# Altium schematic sheet RF_IN.SchDoc
size A3; SheetNumber: 2; SheetTotal: 12
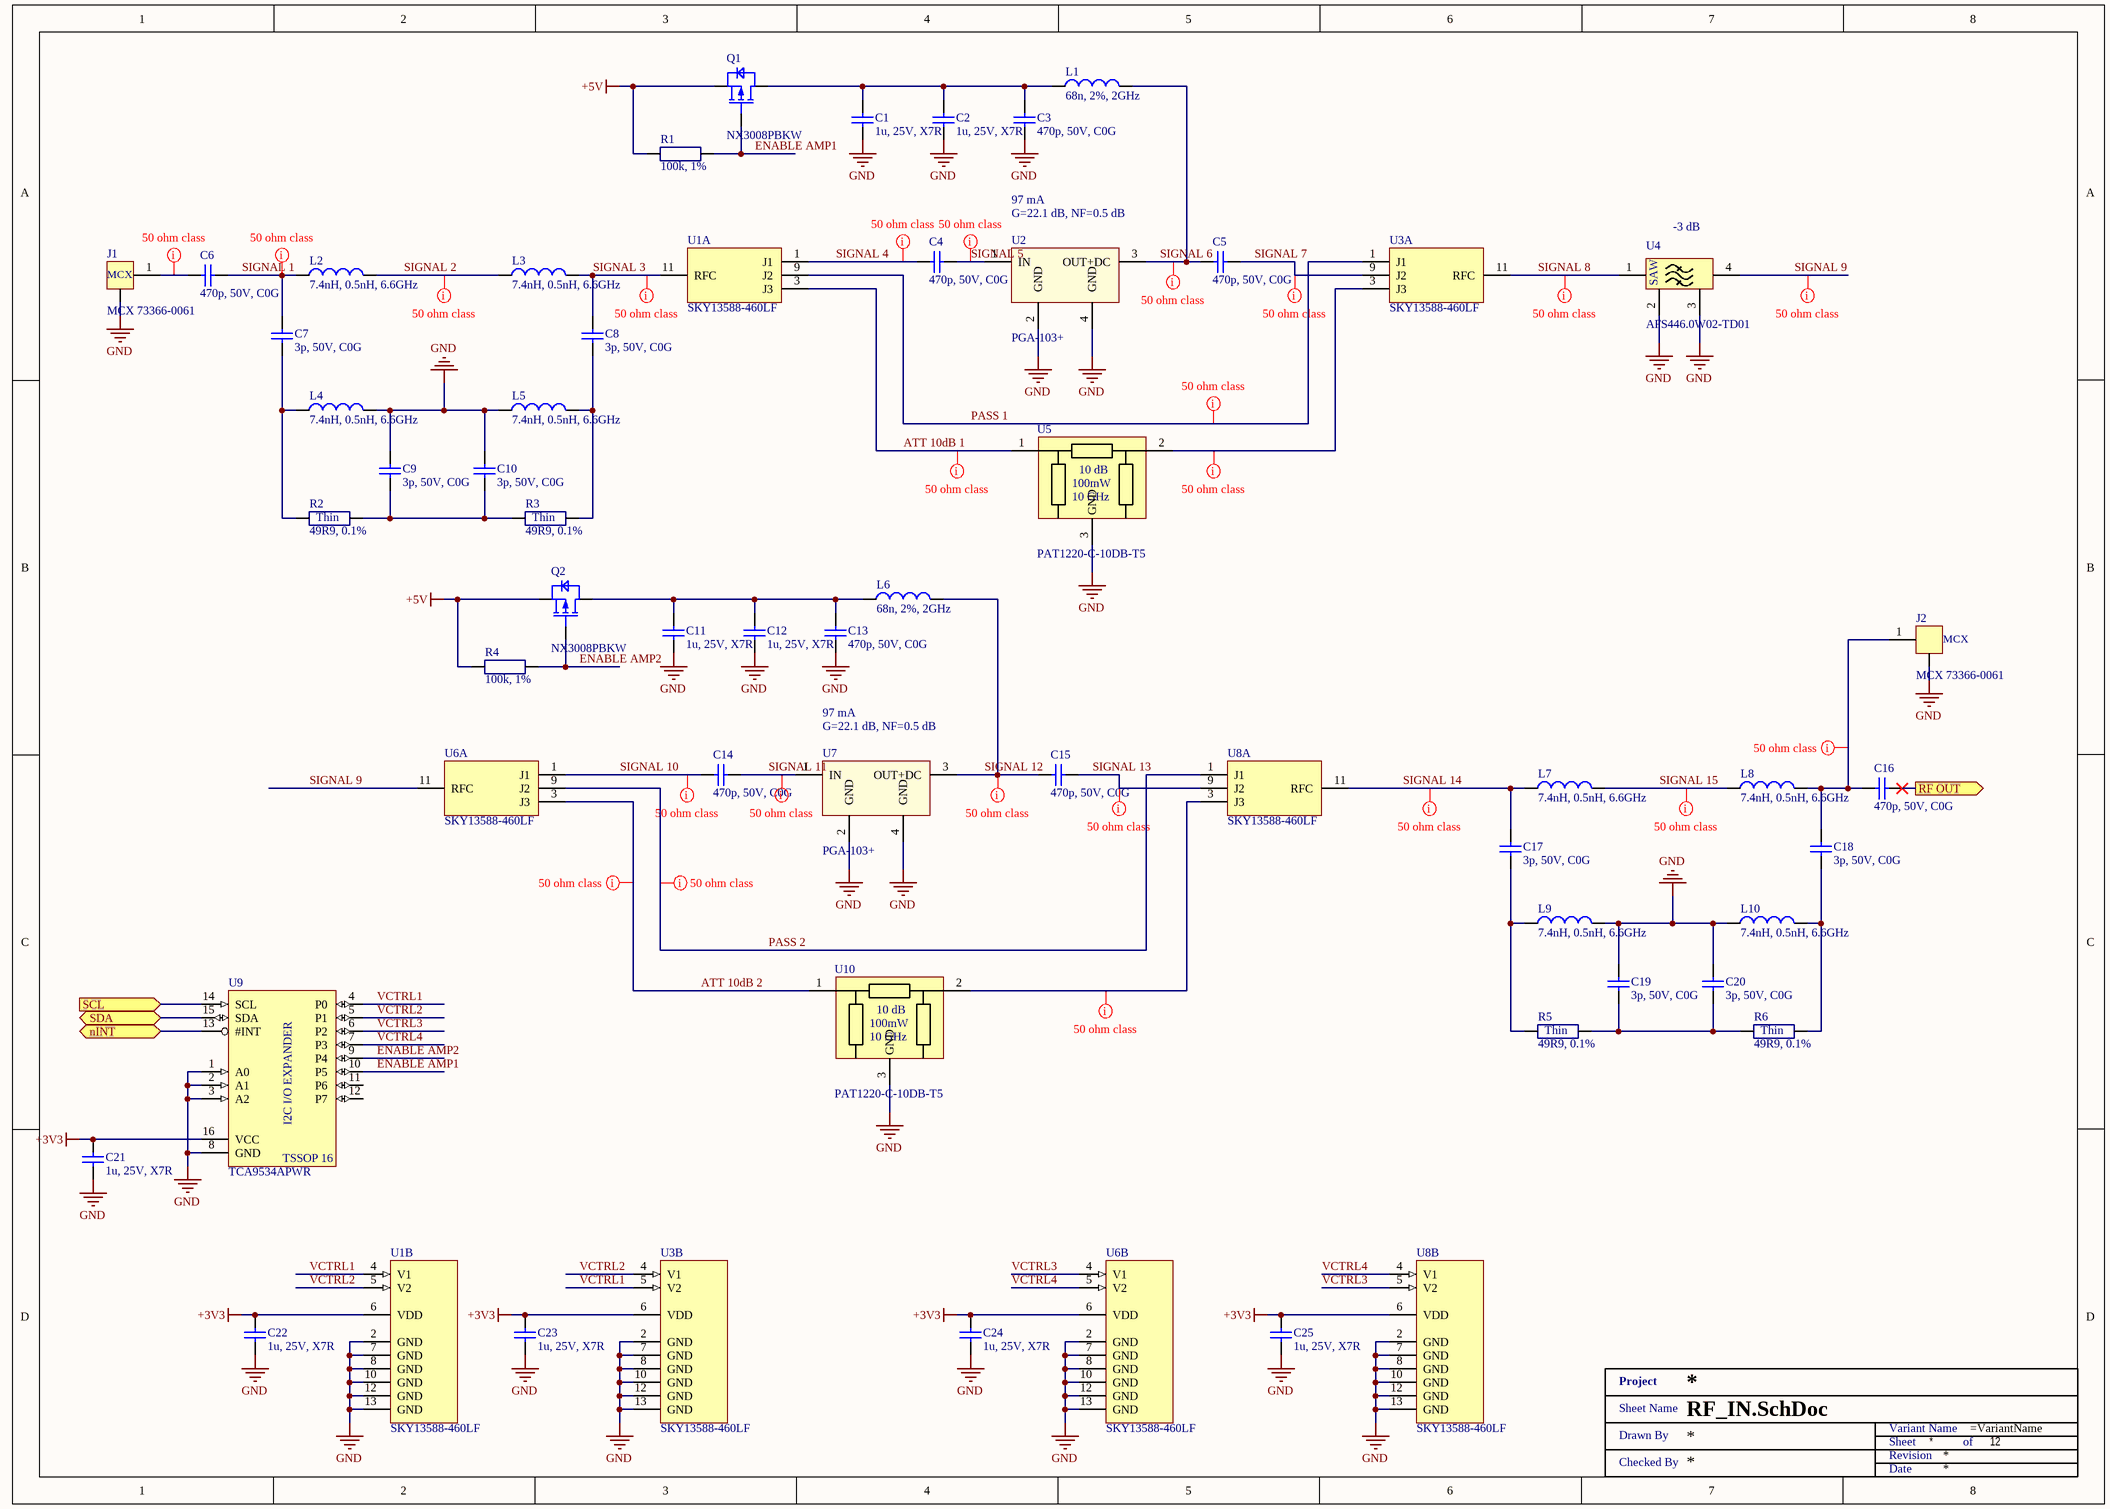
[diagram p0: RF_IN.SchDoc]

## Parts
C1  1u, 25V, X7R  [SMD0603]
C2  1u, 25V, X7R  [SMD0603]
C3  470p, 50V, C0G  [SMD0603]
C4  470p, 50V, C0G  [SMD0603]
C5  470p, 50V, C0G  [SMD0603]
C6  470p, 50V, C0G  [SMD0603]
C7  3p, 50V, C0G  [SMD0402]
C8  3p, 50V, C0G  [SMD0402]
C9  3p, 50V, C0G  [SMD0402]
C10  3p, 50V, C0G  [SMD0402]
C11  1u, 25V, X7R  [SMD0603]
C12  1u, 25V, X7R  [SMD0603]
C13  470p, 50V, C0G  [SMD0603]
C14  470p, 50V, C0G  [SMD0603]
C15  470p, 50V, C0G  [SMD0603]
C16  470p, 50V, C0G  [SMD0603]
C17  3p, 50V, C0G  [SMD0402]
C18  3p, 50V, C0G  [SMD0402]
C19  3p, 50V, C0G  [SMD0402]
C20  3p, 50V, C0G  [SMD0402]
C21  1u, 25V, X7R  [SMD0603]
C22  1u, 25V, X7R  [SMD0603]
C23  1u, 25V, X7R  [SMD0603]
C24  1u, 25V, X7R  [SMD0603]
C25  1u, 25V, X7R  [SMD0603]
J1  MCX 73366-0061  [73366-0061]
J2  MCX 73366-0061  [73366-0061]
L1  68n, 2%, 2GHz  [SMD0603 - L]
L2  7.4nH, 0.5nH, 6.6GHz  [Coilcraft-0402DC]
L3  7.4nH, 0.5nH, 6.6GHz  [Coilcraft-0402DC]
L4  7.4nH, 0.5nH, 6.6GHz  [Coilcraft-0402DC]
L5  7.4nH, 0.5nH, 6.6GHz  [Coilcraft-0402DC]
L6  68n, 2%, 2GHz  [SMD0603 - L]
L7  7.4nH, 0.5nH, 6.6GHz  [Coilcraft-0402DC]
L8  7.4nH, 0.5nH, 6.6GHz  [Coilcraft-0402DC]
L9  7.4nH, 0.5nH, 6.6GHz  [Coilcraft-0402DC]
L10  7.4nH, 0.5nH, 6.6GHz  [Coilcraft-0402DC]
Q1  NX3008PBKW  [SOT323]
Q2  NX3008PBKW  [SOT323]
R1  100k, 1%  [SMD0603 - R]
R2  49R9, 0.1%  [SMD0402 - R]
R3  49R9, 0.1%  [SMD0402 - R]
R4  100k, 1%  [SMD0603 - R]
R5  49R9, 0.1%  [SMD0402 - R]
R6  49R9, 0.1%  [SMD0402 - R]
U1  SKY13588-460LF  [QFN50P200X200X100_HS-13N]  (parts A,B of 2)
U2  PGA-103+  [SOT89]
U3  SKY13588-460LF  [QFN50P200X200X100_HS-13N]  (parts A,B of 2)
U4  AFS446.0W02-TD01  [AFS446.0W02-TD01]
U5  PAT1220-C-10DB-T5  [PAT1220]
U6  SKY13588-460LF  [QFN50P200X200X100_HS-13N]  (parts A,B of 2)
U7  PGA-103+  [SOT89]
U8  SKY13588-460LF  [QFN50P200X200X100_HS-13N]  (parts A,B of 2)
U9  TCA9534APWR  [TSSOP16N]
U10  PAT1220-C-10DB-T5  [PAT1220]
XX?  Title 1  (value not drawn)  (graphical)

## Ports
nINT (bidir), RF OUT (out), SCL (in), SDA (bidir)

## Nets
+3V3: C21.2 C22.2 C23.2 C24.2 C25.2 U1.6(VDD) U3.6(VDD) U6.6(VDD) U8.6(VDD) U9.16(VCC)
+5V: Q1.2(S) Q2.2(S) R1.1 R4.1
GND: C1.1 C2.1 C3.1 C9.2 C10.2 C11.1 C12.1 C13.1 C19.2 C20.2 C21.1 C22.1 C23.1 C24.1 C25.1 J1.2(GND) J2.2(GND) L4.2 L5.1 L9.2 L10.1 U1.2(GND) U1.7(GND) U1.8(GND) U1.10(GND) U1.12(GND) U1.13(GND) U2.2(GND) U2.4(GND) U3.2(GND) U3.7(GND) U3.8(GND) U3.10(GND) U3.12(GND) U3.13(GND) U4.2(GND) U4.3(GND) U5.3(GND) U6.2(GND) U6.7(GND) U6.8(GND) U6.10(GND) U6.12(GND) U6.13(GND) U7.2(GND) U7.4(GND) U8.2(GND) U8.7(GND) U8.8(GND) U8.10(GND) U8.12(GND) U8.13(GND) U9.1(A0) U9.2(A1) U9.3(A2) U9.8(GND) U10.3(GND)
ATT 10dB 1: U1.3(J3) U5.1
ATT 10dB 2: U6.3(J3) U10.1
ENABLE AMP1: Q1.1(G) R1.2 U9.10(P5)
ENABLE AMP2: Q2.1(G) R4.2 U9.9(P4)
nINT: U9.13(#INT) ; port nINT
PASS 1: U1.9(J2) U3.1(J1)
PASS 2: U6.9(J2) U8.1(J1)
RF OUT: C16.2 ; port RF OUT
SCL: U9.14(SCL) ; port SCL
SDA: U9.15(SDA) ; port SDA
SIGNAL 1: C6.2 C7.2 L2.1
SIGNAL 2: L2.2 L3.1
SIGNAL 3: C8.2 L3.2 U1.11(RFC)
SIGNAL 4: C4.1 U1.1(J1)
SIGNAL 5: C4.2 U2.1(IN)
SIGNAL 6: C5.1 L1.2 U2.3(OUT+DC)
SIGNAL 7: C5.2 U3.9(J2)
SIGNAL 8: U3.11(RFC) U4.1(IN)
SIGNAL 9: U4.4(OUT) U6.11(RFC)
SIGNAL 10: C14.1 U6.1(J1)
SIGNAL 11: C14.2 U7.1(IN)
SIGNAL 12: C15.1 L6.2 U7.3(OUT+DC)
SIGNAL 13: C15.2 U8.9(J2)
SIGNAL 14: C17.2 L7.1 U8.11(RFC)
SIGNAL 15: L7.2 L8.1
VCTRL1: U1.4(V1) U3.5(V2) U9.4(P0)
VCTRL2: U1.5(V2) U3.4(V1) U9.5(P1)
VCTRL3: U6.4(V1) U8.5(V2) U9.6(P2)
VCTRL4: U6.5(V2) U8.4(V1) U9.7(P3)
NetC1_2: C1.2 C2.2 C3.2 L1.1 Q1.3(D)
NetC6_1: C6.1 J1.1(INPUT)
NetC7_1: C7.1 L4.1 R2.1
NetC8_1: C8.1 L5.2 R3.2
NetC9_1: C9.1 C10.1 R2.2 R3.1
NetC11_2: C11.2 C12.2 C13.2 L6.1 Q2.3(D)
NetC16_1: C16.1 C18.2 J2.1(INPUT) L8.2
NetC17_1: C17.1 L9.1 R5.1
NetC18_1: C18.1 L10.2 R6.2
NetC19_1: C19.1 C20.1 R5.2 R6.1
NetU3_3: U3.3(J3) U5.2
NetU8_3: U8.3(J3) U10.2

Not connected (* = marked no-connect by the designer): U9 11(P6) 12(P7)

## Layout directives
net class 50 ohm: ATT 10dB 1, ATT 10dB 2, NetC6_1, NetC16_1, NetU3_3, NetU8_3, PASS 1, PASS 2, SIGNAL 1, SIGNAL 2, SIGNAL 3, SIGNAL 4, SIGNAL 5, SIGNAL 6, SIGNAL 7, SIGNAL 8, SIGNAL 9, SIGNAL 10, SIGNAL 11, SIGNAL 12, SIGNAL 13, SIGNAL 14, SIGNAL 15

## Notes on the sheet
- (near U2) G=22.1 dB, NF=0.5 dB
- 97 mA
- (near U4) -3 dB
- (near U7) G=22.1 dB, NF=0.5 dB
- (in symbol AFS446.0W02-TD01) SAW
- (in symbol AT0402BRD0749R9L) Thin
- (in symbol PAT1220-C-10DB-T5) 10 dB; 10 GHz
- (in symbol TCA9534APWR) I2C I/O EXPANDER; TSSOP 16
- (in symbol Title 1) Project; Sheet Name; Variant Name; Drawn By; Sheet; of; Revision; Checked By; Date

## Library data of the parts
C1 C2 C11 C12 C21-C25 = CGA3E1X7R1E105K080AC: CAP CER 1UF 25V X7R 0603; Manufacturer: TDK Corporation; Tolerance: ±10%; Manufacturer Part Number: CGA3E1X7R1E105K080AC; RoHS: RoHS Compliant; Category: Capacitors; Stock 1: 109509; Pricing 1: 1=0.2, 10=0.135, 100=0.0686, 500=0.04696, 1000=0.04154 (USD); Packaging: Cut Tape (CT); Part Status: Active; Voltage - Rated: 25V; Temperature Coefficient: X7R; Operating Temperature: -55°C ~ 125°C; Features: -; Ratings: AEC-Q200; Applications: Automotive; Failure Rate: -; Mounting Type: Surface Mount, MLCC; Package / Case: 0603 (1608 Metric); Size / Dimension: 0.063" L x 0.032" W (1.60mm x 0.80mm); Height - Seated (Max): -; Thickness (Max): 0.035" (0.90mm); Lead Spacing: -; Lead Style: -; ComponentLink1URL: https://product.tdk.com/info/en/catalog/datasheets/mlcc_automotive_general_en.pdf; ComponentLink1Description: https://product.tdk.com/info/en/catalog/datasheets/mlcc_automotive_general_en.pdf; Capacitance: 1u; Supplier 1: Mouser; Supplier Part Number 1: 810-CGA3E1X7R1E105K; Supplier 2: Farnell; Supplier Part Number 2: 2346962; Supplier 3: Digi-Key; Supplier Part Number 3: 445-6931-1-ND
C3-C6 C13-C16 = GCM1885C1H471JA16D: MURATA - GCM1885C1H471JA16D - CAP, MLCC, C0G/NP0, 470PF, 50V, 0603; Ceramic Capacitor Case: 0603 [1608 Metric]; Voltage Rating: 50; Capacitance Tolerance: ± 5%; Product Range: GCM Series; SVHC: No SVHC (17-Dec-2015)<!--FANDB--><div class="features-and-benefits-container"><div class="features-and-benefits-desc-container"><span class="features-and-benefits-container-desc">SMD Multilayer Ceramic Capacitor, 0603 [1608 Metric], 470 pF, 50 V, ± 5%, C0G / NP0, GCM Series</span></div><div class="features-and-benefits-description"><span class="features-benefits-value">The GCM series capacitors from Murata are automotive grade multilayer ceramic chip capacitors (MLCC) used for automotive applications such as power train and safety equipment. The safety equipment includes drive system control, air bags and ABS of engine ECU. These MLCC capacitors are classified into temperature compensating and high dielectric constant types depending on the change in electrostatic capacitance due to change in temperature. The temperature compensating capacitors feature a small rate of change in electrostatic capacitance as the temperature changes. The high dielectric constant capacitors use materials with a high dielectric constant and feature a large electrostatic capacitance.</span></div><div class="features-and-benefits-list"><ul class="features-and-benefits-list-list"><li class="features-and-benefits-list-item">Capacitance values ranges from 0.1pF to 47?F</li><li class="features-and-benefits-list-item">Large capacity and small size in a multilayer structure</li><li class="features-and-benefits-list-item">Tin plated external electrodes, excellent solderability</li><li class="features-and-benefits-list-item">Capacitor size varies from 0.6mm x 0.3mm to 5.7mm x 5.0mm</li><li class="features-and-benefits-list-item">Voltage rating ranges from 6.3VDC to 1000VDC</li><li class="features-and-benefits-list-item">Temperature characteristics are classified according to JIS and EIA standard</li><li class="features-and-benefits-list-item">Operating temperature changes according to temperature coefficient of capacitor</li><li class="features-and-benefits-list-item">Automotive grade AEC-Q200 qualified</li></ul></div><div class="features-and-benefits-applications"><ul class="features-and-benefits-value"><li class="features-and-benefits-list-item">Industrial</li><li class="features-and-benefits-list-item">Consumer Electronics</li><li class="features-and-benefits-list-item">Portable Devices</li><li class="features-and-benefits-list-item">Power Management</li><li class="features-and-benefits-list-item">Safety</li><li class="features-and-benefits-list-item">Automotive</li></ul></div></div>; Supplier 1: Farnell; Supplier Part Number 1: 2494192; Manufacturer: MURATA; Manufacturer Part Number: GCM1885C1H471JA16D; RoHS: YES; Stock 1: 10240; Pricing 1: 10=0.0277, 100=0.0184, 500=0.0139, 1000=0.0111, 2000=0.0103, 4000=0.0091, 20000=0.0077, 40000=0.0071 (GBP); Capacitance: 470p; Dielectric Characteristic: C0G / NP0; Packaging: Cut Tape; Operating Temperature Min: -55; Operating Temperature Max: 125; Automotive Qualification Standard: -; MSL: MSL 6 - Time on Label; ComponentLink1URL: http://www.farnell.com/datasheets/1955642.pdf; ComponentLink1Description: http://www.farnell.com/datasheets/1955642.pdf; Supplier 2: Digi-Key; Supplier Part Number 2: 490-4965-1-ND
C7-C10 C17-C20 = GJM1555C1H3R0WB01D: CAP CER 3PF 50V C0G/NP0 0402; Manufacturer: Murata; Supplier 1: Mouser; Supplier Part Number 1: 81-GJM1555C1H3R0WB1D; Manufacturer Part Number: GJM1555C1H3R0WB01D; RoHS: Yes; Category: Ceramic Capacitors; Stock 1: 79370; Pricing 1: 1=0.27000, 10=0.18500, 50=0.18500, 100=0.10500, 500=0.07400, 1000=0.06500, 2500=0.06200, 5000=0.05700, 10000=0.04700 (USD); Mount: Surface Mount; Case/Package: 0402; Case Code (Imperial): 0402; Case Code (Metric): 1005; Min Operating Temperature: -55°C; Max Operating Temperature: 125°C; Capacitance: 3pF; Package Quantity: 10000; Packaging: Tape and Reel; Voltage Rating: 50V; Dielectric: C0G; Voltage Rating (DC): 50V; Termination: SMD/SMT; Series: GJM; Construction: Flat; Length: 1mm; Width: 0.5mm; Height: 0.5mm; Thickness: 0.022inch; Depth: 0.5mm; Radiation Hardening: No; RoHS Compliant: Yes; ComponentLink1URL: http://www.mouser.com/ds/2/281/c02e-2905.pdf?src-supplier=Mouser; ComponentLink1Description: http://www.mouser.com/ds/2/281/c02e-2905.pdf?src-supplier=Mouser; ComponentLink2URL: http://search.murata.co.jp/Ceramy/image/img/PDF/ENG/GJM1555C1H3R0WB01.pdf?src-supplier=Avnet; ComponentLink2Description: http://search.murata.co.jp/Ceramy/image/img/PDF/ENG/GJM1555C1H3R0WB01.pdf?src-supplier=Avnet; ComponentLink3URL: http://search.murata.co.jp/Ceramy/image/img/A01X/G101/ENG/GJM1555C1H3R0WB01-01.pdf?src-supplier=Digi-Key; ComponentLink3Description: http://search.murata.co.jp/Ceramy/image/img/A01X/G101/ENG/GJM1555C1H3R0WB01-01.pdf?src-supplier=Digi-Key; ComponentLink4URL: http://search.murata.co.jp/Ceramy/image/img/A01X/partnumbering_e_01.pdf?src-supplier=Digi-Key; ComponentLink4Description: http://search.murata.co.jp/Ceramy/image/img/A01X/partnumbering_e_01.pdf?src-supplier=Digi-Key; ComponentLink5URL: http://components.arrow.com/part/dataview/46522145S277297N2606?src-supplier=Arrow+Electronics; ComponentLink5Description: http://components.arrow.com/part/dataview/46522145S277297N2606?src-supplier=Arrow+Electronics; Supplier 2: Farnell; Supplier Part Number 2: 3243232; Supplier 3: Digi-Key; Supplier Part Number 3: 490-11211-1-ND; Supplier 4: RSComponents; Supplier Part Number 4: 1853162
J1 J2 = 73366-0061: CONN MCX JACK STR 50 OHM PCB; Manufacturer: Molex, LLC; Manufacturer Part Number: 0733660061; Connector Type: Jack, Female Socket; Contact Termination: Solder; Impedance: 50 Ohm; Body Material: Brass; Body Finish: Gold; Dielectric Material: Polytetrafluoroethylene (PTFE); Center Contact Material: Beryllium Copper; Mating Cycles: 500; RoHS: RoHS Compliant; Category: Connectors, Interconnects; Stock 1: 39394; Pricing 1: 1=1.95, 10=1.765, 25=1.6572, 50=1.5854, 100=1.5133, 250=1.36916, 500=1.26106, 1000=1.0809, 2500=1.00884 (USD); Packaging: Tray; Part Status: Active; Connector Style: MCX; Shield Termination: Solder; Mounting Type: Through Hole; Mounting Feature: -; Cable Group: -; Fastening Type: Snap-On; Features: -; Housing Color: Gold; Ingress Protection: -; Includes: -; Center Contact Plating: Gold; Operating Temperature: -55°C ~ 155°C; Insertion Loss: -; ComponentLink1URL: https://www.molex.com/pdm_docs/sd/733660061_sd.pdf; ComponentLink1Description: https://www.molex.com/pdm_docs/sd/733660061_sd.pdf; Supplier 1: Mouser; Supplier Part Number 1: 538-73366-0061; Supplier 2: Digi-Key; Supplier Part Number 2: WM5541-ND; Supplier 3: Farnell; Supplier Part Number 3: 1909245
L1 L6 = 0603HP-68NXGLU: Fixed Inductors 0603HP Hi Perfrmnce 68 nH 2 % 0.6 A; Manufacturer: Coilcraft; Core Material: Ceramic; Q Factor: 49; Max DC Current: 600mA; DC Resistance (DCR): 330mR; Test Frequency: 200MHz; Supplier 1: Mouser; Supplier Part Number 1: 994-0603HP-68NXGLU; Manufacturer Part Number: 0603HP-68NXGLU; Stock 1: 2486; Pricing 1: 1=1.18000, 10=1.18000, 50=1.18000, 100=1.18000, 200=0.89000, 500=0.66000 (USD); RoHS: Yes; Mount: Surface Mount; Case/Package: 0603; Case Code (Metric): 1608; Case Code (Imperial): 0603; Min Operating Temperature: -40°C; Max Operating Temperature: 125°C; Packaging: Tape and Reel; Package Quantity: 100; Tolerance: 2%; Inductance: 68n; Self Resonant Frequency: 2GHz; Termination: SMD/SMT; Inductance Tolerance: 2%; Current Rating: 600mA; Length: 1.75mm; Height: 0.94mm; Width: 1.09mm; Lead Free: Contains Lead; REACH SVHC: No SVHC; ComponentLink1URL: https://datasheet.ciiva.com/22709/1681881-22709625.pdf?src-supplier=Element14; ComponentLink1Description: https://datasheet.ciiva.com/22709/1681881-22709625.pdf?src-supplier=Element14; Supplier 2: Farnell; Supplier Part Number 2: 2286163
L2-L5 L7-L10 = LQW15AN7N4D10D: Ind Chip Wirewound 7.4nH 0.5nH 0402 Paper T/R; Manufacturer: Murata; Supplier 1: Mouser; Supplier Part Number 1: 81-LQW15AN7N4D10D; Manufacturer Part Number: LQW15AN7N4D10D; Category: Fixed Inductors; Stock 1: 9490; Pricing 1: 1=0.21000, 10=0.17900, 50=0.17900, 100=0.11900, 1000=0.08300, 10000=0.05700 (USD); ComponentLink1URL: https://datasheet.octopart.com/LQW15AN7N4D10D-Murata-datasheet-138758294.pdf?src-supplier=Ciiva+Crawler; ComponentLink1Description: https://datasheet.octopart.com/LQW15AN7N4D10D-Murata-datasheet-138758294.pdf?src-supplier=Ciiva+Crawler; ComponentLink2URL: https://datasheet.octopart.com/LQW15AN7N4D10D-Murata-datasheet-140717249.pdf?src-supplier=Ciiva+Crawler; ComponentLink2Description: https://datasheet.octopart.com/LQW15AN7N4D10D-Murata-datasheet-140717249.pdf?src-supplier=Ciiva+Crawler; ComponentLink3URL: https://datasheet.octopart.com/LQW15AN7N4D10D-Murata-datasheet-141294512.pdf?src-supplier=Ciiva+Crawler; ComponentLink3Description: https://datasheet.octopart.com/LQW15AN7N4D10D-Murata-datasheet-141294512.pdf?src-supplier=Ciiva+Crawler; ComponentLink4URL: https://datasheet.octopart.com/LQW15AN7N4D10D-Murata-datasheet-142541909.pdf?src-supplier=Ciiva+Crawler; ComponentLink4Description: https://datasheet.octopart.com/LQW15AN7N4D10D-Murata-datasheet-142541909.pdf?src-supplier=Ciiva+Crawler; ComponentLink5URL: https://datasheet.octopart.com/LQW15AN7N4D10D-Murata-datasheet-140317909.pdf?src-supplier=Farnell; ComponentLink5Description: https://datasheet.octopart.com/LQW15AN7N4D10D-Murata-datasheet-140317909.pdf?src-supplier=Farnell; ComponentLink6URL: https://datasheet.octopart.com/LQW15AN7N4D10D-Murata-datasheet-145452064.pdf?src-supplier=Geoflip; ComponentLink6Description: https://datasheet.octopart.com/LQW15AN7N4D10D-Murata-datasheet-145452064.pdf?src-supplier=Geoflip; Supplier 2: Farnell; Supplier Part Number 2: 3356519; Supplier 3: Digi-Key; Supplier Part Number 3: 490-LQW15AN7N4D10DTR-ND
Q1 Q2 = NX3008PBKW: NXP - NX3008PBKW - MOSFET, P CH, 30V, 200MA, SOT323; Transistor Polarity: P Channel; Continuous Drain Current Id: -200; Drain Source Voltage Vds: -30; On Resistance Rds(on): 2.8; Rds(on) Test Voltage Vgs: -4.5; Threshold Voltage Vgs: -900; Power Dissipation Pd: 260; Transistor Case Style: SOT-323; No. of Pins: 3; SVHC: No SVHC (17-Dec-2015); Pulse Current Idm: -0.8; Voltage Vgs th Max: 8V<!--FANDB--><div class="features-and-benefits-container"><div class="features-and-benefits-description"><span class="features-benefits-value">The NX3008PBKW is a P-channel enhancement mode Field-Effect Transistor (FET) in surface mount plastic package using Trench MOSFET technology. Suitable for relay driver, high-speed line driver and high-side loadswitch.</span></div><div class="features-and-benefits-list"><ul class="features-and-benefits-list-list"><li class="features-and-benefits-list-item">Logic-level compatible</li><li class="features-and-benefits-list-item">Very fast switching</li><li class="features-and-benefits-list-item">AEC-Q101 Qualified</li><li class="features-and-benefits-list-item">Up to 1; Supplier 1: Farnell; Supplier Part Number 1: 2069551; Manufacturer: NXP; Manufacturer Part Number: NX3008PBKW; RoHS: YES; Stock 1: 18626; Pricing 1: 1=0.037, 25=0.0347, 100=0.0323, 250=0.03, 500=0.0294, 2000=0.0288, 4000=0.0282, 20000=0.0276 (GBP); Operating Temperature Max: 150; Product Range: -; Automotive Qualification Standard: -; MSL: MSL 1 - Unlimited; Operating Temperature Min: -55; Operating Temperature Range: -55°C to +150; ComponentLink1URL: http://www.farnell.com/datasheets/1508398.pdf; ComponentLink1Description: http://www.farnell.com/datasheets/1508398.pdf; Supplier 2: Digi-Key; Supplier Part Number 2: 568-10503-1-ND
R1 R4 = RC0603FR-07100KL: RES SMD 100K OHM 1% 1/10W 0603; Manufacturer: Yageo; Power (Watts): 0.1W, 1/10W; Temperature Coefficient: ±100ppm/°C; Manufacturer Part Number: RC0603FR-07100KL; RoHS: RoHS Compliant; Category: Resistors; Stock 1: 14618646; Pricing 1: 1=0.1, 10=0.015, 100=0.006, 1000=0.00268, 2500=0.00233 (USD); Packaging: Cut Tape (CT); Part Status: Active; Tolerance: ±1%; Composition: Thick Film; Features: Moisture Resistant; Operating Temperature: -55°C ~ 155°C; Package / Case: 0603 (1608 Metric); Supplier Device Package: 0603; Size / Dimension: 0.063" L x 0.032" W (1.60mm x 0.80mm); Height - Seated (Max): 0.022" (0.55mm); Failure Rate: -; ComponentLink1URL: http://www.yageo.com/documents/recent/PYu-RC_Group_51_RoHS_L_8.pdf; ComponentLink1Description: http://www.yageo.com/documents/recent/PYu-RC_Group_51_RoHS_L_8.pdf; Resistance: 100k; Supplier 1: Mouser; Supplier Part Number 1: 603-RC0603FR-07100KL; Supplier 2: Farnell; Supplier Part Number 2: 9238727; Supplier 3: Digi-Key; Supplier Part Number 3: 311-100KHRCT-ND
R2 R3 R5 R6 = AT0402BRD0749R9L: Thin Film Resistors - SMD 49.9 Ohms 0.1% Tol. AEC-Q200; Manufacturer: Yageo; Power Rating: 62.5 mW (1/16 W); Temperature Coefficient: 25 PPM / C; Voltage Rating: 50 V; CNHTS: 8533211000; MXHTS: 85332101; TARIC: 8533210000; Supplier 1: Mouser; Supplier Part Number 1: 603-AT0402BRD0749R9L; Manufacturer Part Number: AT0402BRD0749R9L; RoHS: RoHS Compliant; Category: Thin Film Resistors - SMD; Stock 1: 9662; Pricing 1: 1=0.594, 10=0.346, 100=0.139, 1000=0.106, 2500=0.081, 10000=0.079, 20000=0.077 (EUR); Diameter: -; Features: -; Height: 0.3 mm; Length: 1 mm; Operating Temperature Range: - 55 C to + 125 C; Package / Case: 0402 (1005 metric); Packaging: Cut Tape; Product: Thin Film Resistors SMD; Resistance: 49.9 Ohms; Series: AT; Termination Style: SMD/SMT; Tolerance: 0.1 %; Type: High Precision High Stability Chip Resistors; Width: 0.5 mm; Brand: Yageo; Mounting Style: PCB Mount; Case Code - in: 0402; Case Code - mm: 1005; HTS Code: 8533210030; Maximum Operating Temperature: + 125 C; Minimum Operating Temperature: - 55 C; Product Type: Thin Film Resistors; Qualification: AEC-Q200; Standard Pack Qty: 10000; Subcategory: Resistors; RoHS - Mouser: Y; Minimum Order Quantity: 1; Reeling: True; ComponentLink1URL: http://www.mouser.com/datasheet/2/447/PYu-AT_51_RoHS_L_5-1222714.pdf; ComponentLink1Description: http://www.mouser.com/datasheet/2/447/PYu-AT_51_RoHS_L_5-1222714.pdf
U1 U3 U6 U8 = SKY13588-460LF: RF Switch, SP3T, 0.1 - 6.0 GHz, 0.45 dB IL, 30 dB isolation, SOI, 12-pin QFN pkg; Manufacturer: Skyworks Solutions; Impedance: 50R; IIP3: 70dBm; Supplier 1: Mouser; Supplier Part Number 1: 873-SKY13588-460LF; Manufacturer Part Number: SKY13588-460LF; RoHS: Yes; Category: RF Semiconductors and Devices; Stock 1: 5209; Pricing 1: 1=1.27000, 10=1.09000, 50=1.09000, 100=0.83300, 1000=0.58200, 10000=0.48100 (USD); Case/Package: QFN; Min Operating Temperature: -40°C; Max Operating Temperature: 105°C; Packaging: Tape and Reel; Throw Configuration: SP3T; RoHS Compliant: Yes; ComponentLink1URL: http://www.mouser.com/ds/2/472/SKY13588_460LF_203512B-875813.pdf?src-supplier=Mouser; ComponentLink1Description: http://www.mouser.com/ds/2/472/SKY13588_460LF_203512B-875813.pdf?src-supplier=Mouser; ComponentLink2URL: http://www.skyworksinc.com/uploads/documents/SKY13588_460LF_203512D.pdf?src-supplier=Digi-Key; ComponentLink2Description: http://www.skyworksinc.com/uploads/documents/SKY13588_460LF_203512D.pdf?src-supplier=Digi-Key; Supplier 2: Digi-Key; Supplier Part Number 2: 863-1817-1-ND
U2 U7 = PGA-103+: LNA NF=0.6dB ML AMPL / SURF MT / 4GHZ RoHS; Manufacturer: Mini-Circuits; Supplier 1: Mouser; Supplier Part Number 1: 139-PGA-103; Manufacturer Part Number: PGA-103+; Category: RF Amplifiers; Stock 1: 449; Pricing 1: 1=3.67000, 10=3.28000, 50=3.28000, 100=2.69000, 1000=1.83000, 10000=1.74000 (USD); RoHS Compliant: Yes; ComponentLink1URL: https://datasheet.octopart.com/PGA-103%2B-Mini-Circuits-datasheet-79796973.pdf?src-supplier=Component+Distributors+Inc.; ComponentLink1Description: https://datasheet.octopart.com/PGA-103%2B-Mini-Circuits-datasheet-79796973.pdf?src-supplier=Component+Distributors+Inc.; Supplier 2: Digi-Key; Supplier Part Number 2: 3157-PGA-103+CT-ND
U4 = AFS446.0W02-TD01: Saw Filters 446MHz; Manufacturer: Abracon; Voltage Rating (DC): 10V; Impedance: 50R; Insertion Loss: 4.5dB; Supplier 1: Mouser; Supplier Part Number 1: 815-AFS446.0W2-TD1; Manufacturer Part Number: AFS446.0W02-TD01; RoHS: Yes; Category: EMI / RFI Components; Stock 1: 608; Pricing 1: 1=0.93000, 10=0.85800, 50=0.70100, 100=0.57200, 1000=0.48600, 10000=0.34600 (USD); Min Operating Temperature: -40°C; Max Operating Temperature: 80°C; Frequency: 446MHz; Termination: Radial; RoHS Compliant: Yes; ComponentLink1URL: https://datasheet.ciiva.com/4548/afs446-0w02-td01-43048-4548368.pdf?src-supplier=Mouser; ComponentLink1Description: https://datasheet.ciiva.com/4548/afs446-0w02-td01-43048-4548368.pdf?src-supplier=Mouser
U5 U10 = PAT1220-C-10DB-T5: Chip Attenuator 10GHz 10dB, 100mW; Manufacturer: Susumu; Impedance: 50R; Supplier 1: Mouser; Supplier Part Number 1: 754-PAT1220C10DBT5; Manufacturer Part Number: PAT1220-C-10DB-T5; RoHS: Yes; Category: Uncategorized; Pricing 1: 1=0.35000, 10=0.30800, 25=0.27800, 100=0.24300, 250=0.21300, 500=0.18800, 1000=0.14800, 5000=0.12500, 10000=0.12000 (USD); Case/Package: 0805; Number of Pins: 3; Case Code (Metric): 2012; Case Code (Imperial): 0805; Max Power Dissipation: 100mW; Package Quantity: 1; Packaging: Tape and Reel; Attenuation Value: 10dB; Lead Free: Lead Free; ComponentLink1URL: https://datasheet.ciiva.com/15101/getdatasheetpartid-483968-15101130.pdf?src-supplier=Verical; ComponentLink1Description: https://datasheet.ciiva.com/15101/getdatasheetpartid-483968-15101130.pdf?src-supplier=Verical; ComponentLink2URL: https://datasheet.ciiva.com/2788/products-38-2788376.pdf?src-supplier=Digi-Key; ComponentLink2Description: https://datasheet.ciiva.com/2788/products-38-2788376.pdf?src-supplier=Digi-Key; ComponentLink3URL: https://datasheet.ciiva.com/2788/products-38-2788374.pdf?src-supplier=Digi-Key; ComponentLink3Description: https://datasheet.ciiva.com/2788/products-38-2788374.pdf?src-supplier=Digi-Key; ComponentLink4URL: https://datasheet.ciiva.com/2788/products-38-2788375.pdf?src-supplier=Digi-Key; ComponentLink4Description: https://datasheet.ciiva.com/2788/products-38-2788375.pdf?src-supplier=Digi-Key
U9 = TCA9534APWR: IC I/O EXPANDER I2C 8B 16TSSOP; Manufacturer: Texas Instruments; Number of I/Os: 8; Frequency: 400kHz; Supplier 1: Mouser; Supplier Part Number 1: 595-TCA9534APWR; Manufacturer Part Number: TCA9534APWR; Stock 1: 3614; Pricing 1: 1 = 1.25000, 10 = 1.07000, 50 = 1.07000, 100 = 0.81500, 500 = 0.72100, 1000 = 0.56900, 2000 = 0.50500, 10000 = 0.48600, 24000 = 0.47000, 50000 = 0.45500 (USD); RoHS: Yes; Mount: Surface Mount; Case/Package: TSSOP; Number of Pins: 16; Contact Plating: Gold; Min Operating Temperature: -40°C; Max Operating Temperature: 85°C; Packaging: Tape and Reel; Interface: I2C; Number of Outputs: 8; Lead Free: Lead Free; ComponentLink1URL: http://www.ti.com/general/docs/lit/getliterature.tsp?genericPartNumber=TCA9534A&&fileType=pdf&src-supplier=Avnet; ComponentLink1Description: http://www.ti.com/general/docs/lit/getliterature.tsp?genericPartNumber=TCA9534A&&fileType=pdf&src-supplier=Avnet; ComponentLink2URL: http://www.ti.com/lit/ds/symlink/tca9534a.pdf?src-supplier=Digi-Key; ComponentLink2Description: http://www.ti.com/lit/ds/symlink/tca9534a.pdf?src-supplier=Digi-Key; ComponentLink3URL: http://www.ti.com/general/docs/lit/getliterature.tsp?genericPartNumber=TCA9534A&&fileType=pdf&src-supplier=Avnet+Asia; ComponentLink3Description: http://www.ti.com/general/docs/lit/getliterature.tsp?genericPartNumber=TCA9534A&&fileType=pdf&src-supplier=Avnet+Asia; ComponentLink4URL: http://www.ti.com/lit/pdf/sszc003?src-supplier=Digi-Key; ComponentLink4Description: http://www.ti.com/lit/pdf/sszc003?src-supplier=Digi-Key; Supplier 2: Digi-Key; Supplier Part Number 2: 296-40573-1-ND; Supplier 3: Arrow; Supplier Part Number 3: TCA9534APWR